# EAGLE schematic sigother (EAGLE 6.2)
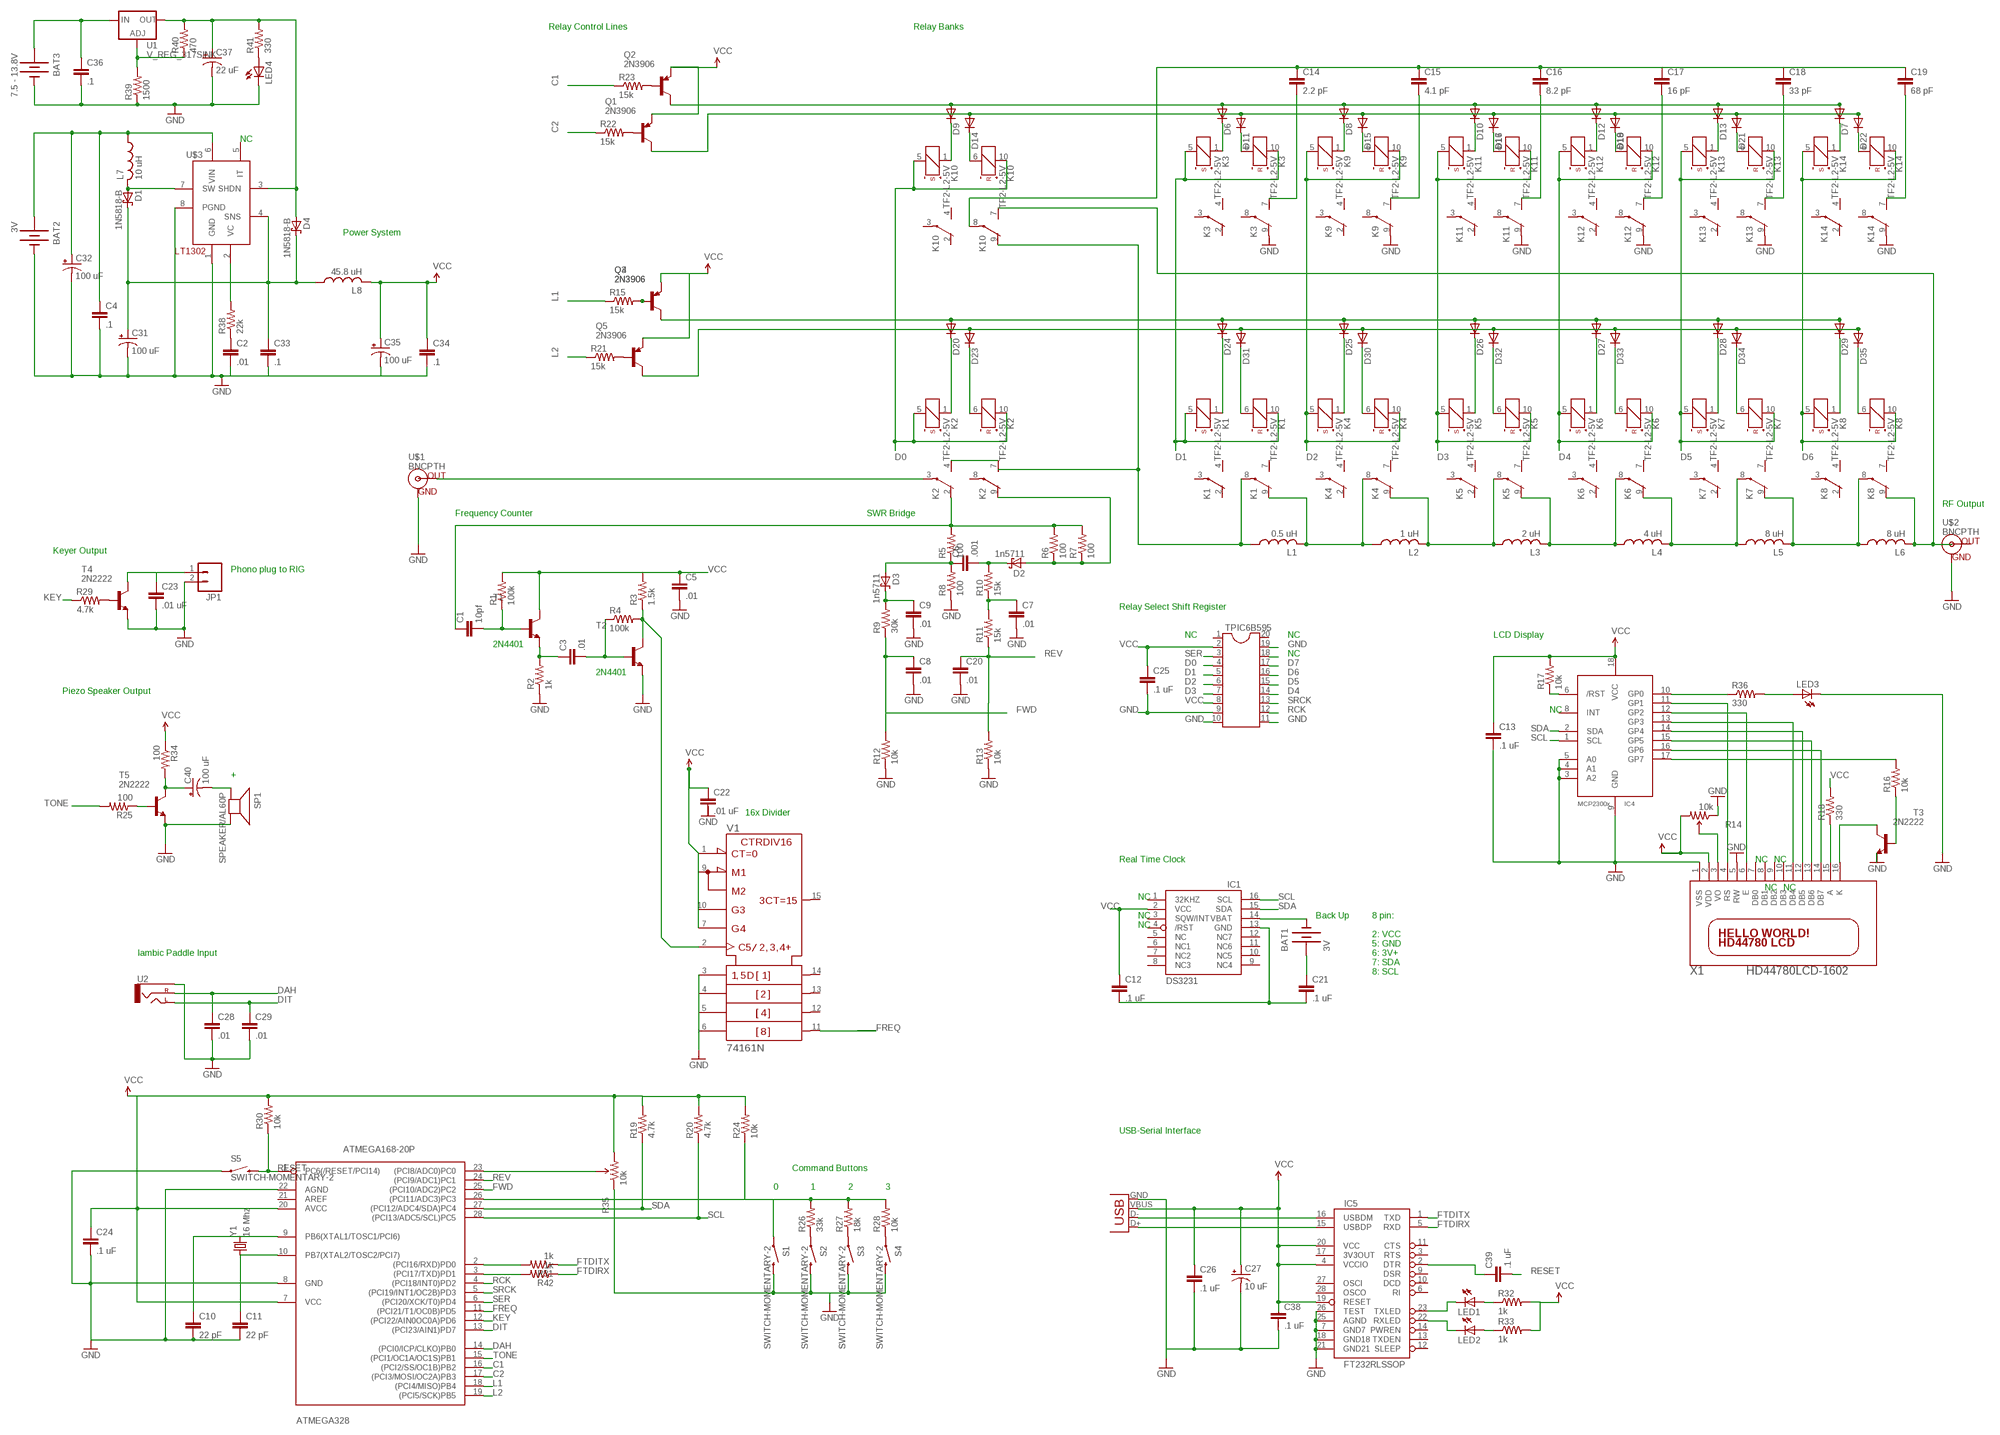
[diagram p0: schematic, sheet 1]

## Parts
ATMEGA328  ATMEGA168-20P  [DIL28-3]
BAT1  3V  BATTERY12PTH  [BATTCON_12MM_PTH]
BAT2  3V  BATTERYAA  [BATTERY-AA]
BAT3  7.5 - 13.8V  BATTERYAA  [BATTERY-AA]
C1  10pf  CAPKIT  [CAP-PTH-SMALL-KIT]
C2  .01  CAPKIT  [CAP-PTH-SMALL-KIT]
C3  .01  CAPKIT  [CAP-PTH-SMALL-KIT]
C4  .1  CAPKIT  [CAP-PTH-SMALL-KIT]
C5  .01  CAPKIT  [CAP-PTH-SMALL-KIT]
C6  .001  CAPKIT  [CAP-PTH-SMALL-KIT]
C7  .01  CAPKIT  [CAP-PTH-SMALL-KIT]
C8  .01  CAPKIT  [CAP-PTH-SMALL-KIT]
C9  .01  CAPKIT  [CAP-PTH-SMALL-KIT]
C10  22 pF  CAPKIT  [CAP-PTH-SMALL-KIT]
C11  22 pF  CAPKIT  [CAP-PTH-SMALL-KIT]
C12  .1 uF  CAPKIT  [CAP-PTH-SMALL-KIT]
C13  .1 uF  CAPKIT  [CAP-PTH-SMALL-KIT]
C14  2.2 pF  CAPKIT  [CAP-PTH-SMALL-KIT]
C15  4.1 pF  CAPKIT  [CAP-PTH-SMALL-KIT]
C16  8.2 pF  CAPKIT  [CAP-PTH-SMALL-KIT]
C17  16 pF  CAPKIT  [CAP-PTH-SMALL-KIT]
C18  33 pF  CAPKIT  [CAP-PTH-SMALL-KIT]
C19  68 pF  CAPKIT  [CAP-PTH-SMALL-KIT]
C20  .01  CAPKIT  [CAP-PTH-SMALL-KIT]
C21  .1 uF  CAPKIT  [CAP-PTH-SMALL-KIT]
C22  .01 uF  CAPKIT  [CAP-PTH-SMALL-KIT]
C23  .01 uF  CAPKIT  [CAP-PTH-SMALL-KIT]
C24  .1 uF  CAPKIT  [CAP-PTH-SMALL-KIT]
C25  .1 uF  CAPKIT  [CAP-PTH-SMALL-KIT]
C26  .1 uF  CAPKIT  [CAP-PTH-SMALL-KIT]
C27  10 uF  CAP_POLPTH1  [CPOL-RADIAL-100UF-25V]
C28  .01  CAPKIT  [CAP-PTH-SMALL-KIT]
C29  .01  CAPKIT  [CAP-PTH-SMALL-KIT]
C31  100 uF  CAP_POLPTH1  [CPOL-RADIAL-100UF-25V]
C32  100 uF  CAP_POLPTH1  [CPOL-RADIAL-100UF-25V]
C33  .1  CAPKIT  [CAP-PTH-SMALL-KIT]
C34  .1  CAPKIT  [CAP-PTH-SMALL-KIT]
C35  100 uF  CAP_POLPTH1  [CPOL-RADIAL-100UF-25V]
C36  .1  CAPKIT  [CAP-PTH-SMALL-KIT]
C37  22 uF  CAP_POLPTH1  [CPOL-RADIAL-100UF-25V]
C38  .1 uF  CAPKIT  [CAP-PTH-SMALL-KIT]
C39  .1 uF  CAPKIT  [CAP-PTH-SMALL-KIT]
C40  100 uF  CAP_POLPTH1  [CPOL-RADIAL-100UF-25V]
D1  1N5818-B  [DO41-7.6]
D2  1n5711  SCHOTTKY-DIODEC4111-15  [C4111-15]
D3  1n5711  SCHOTTKY-DIODEC4111-15  [C4111-15]
D4  1N5818-B  [DO41-7.6]
D6  DIODE1N4148  [DIODE-1N4148]
D7  DIODE1N4148  [DIODE-1N4148]
D8  DIODE1N4148  [DIODE-1N4148]
D9  DIODE1N4148  [DIODE-1N4148]
D10  DIODE1N4148  [DIODE-1N4148]
D11  DIODE1N4148  [DIODE-1N4148]
D12  DIODE1N4148  [DIODE-1N4148]
D13  DIODE1N4148  [DIODE-1N4148]
D14  DIODE1N4148  [DIODE-1N4148]
D15  DIODE1N4148  [DIODE-1N4148]
D16  DIODE1N4148  [DIODE-1N4148]
D17  DIODE1N4148  [DIODE-1N4148]
D18  DIODE1N4148  [DIODE-1N4148]
D19  DIODE1N4148  [DIODE-1N4148]
D20  DIODE1N4148  [DIODE-1N4148]
D21  DIODE1N4148  [DIODE-1N4148]
D22  DIODE1N4148  [DIODE-1N4148]
D23  DIODE1N4148  [DIODE-1N4148]
D24  DIODE1N4148  [DIODE-1N4148]
D25  DIODE1N4148  [DIODE-1N4148]
D26  DIODE1N4148  [DIODE-1N4148]
D27  DIODE1N4148  [DIODE-1N4148]
D28  DIODE1N4148  [DIODE-1N4148]
D29  DIODE1N4148  [DIODE-1N4148]
D30  DIODE1N4148  [DIODE-1N4148]
D31  DIODE1N4148  [DIODE-1N4148]
D32  DIODE1N4148  [DIODE-1N4148]
D33  DIODE1N4148  [DIODE-1N4148]
D34  DIODE1N4148  [DIODE-1N4148]
D35  DIODE1N4148  [DIODE-1N4148]
IC1  DS3231/SO  [SO16W]
IC4  MCP2300X/P  [DIL18]
IC5  FT232RLSSOP  [SSOP28DB]
JP1  M02LOCK_LONGPADS  [1X02_LOCK_LONGPADS]
K1  TF2-L2-5V  [TF2]
K2  TF2-L2-5V  [TF2]
K3  TF2-L2-5V  [TF2]
K4  TF2-L2-5V  [TF2]
K5  TF2-L2-5V  [TF2]
K6  TF2-L2-5V  [TF2]
K7  TF2-L2-5V  [TF2]
K8  TF2-L2-5V  [TF2]
K9  TF2-L2-5V  [TF2]
K10  TF2-L2-5V  [TF2]
K11  TF2-L2-5V  [TF2]
K12  TF2-L2-5V  [TF2]
K13  TF2-L2-5V  [TF2]
K14  TF2-L2-5V  [TF2]
L1  0.5 uH  L-USTJ5-U1  [TJ5-U1]
L2  1 uH  L-USTJ5-U1  [TJ5-U1]
L3  2 uH  L-USTJ5-U1  [TJ5-U1]
L4  4 uH  L-USTJ5-U1  [TJ5-U1]
L5  8 uH  L-USTJ5-U1  [TJ5-U1]
L6  8 uH  L-USTJ5-U1  [TJ5-U1]
L7  10 uH  L-USTJ5-U1  [TJ5-U1]
L8  45.8 uH  L-USTJ5-U1  [TJ5-U1]
LED1  LED-3MM-NO_SILK  [LED3MM-NS]
LED2  LED-3MM-NO_SILK  [LED3MM-NS]
LED3  LED3MM  [LED3MM]
LED4  LED3MM  [LED3MM]
Q1  2N3906  [TO92]
Q2  2N3906  [TO92]
Q3  2N3906  [TO92]
Q4  2N3906  [TO92]
Q5  2N3906  [TO92]
R1  100k  RESISTORPTH-1/4W  [AXIAL-0.4]
R2  1k  RESISTORPTH-1/4W  [AXIAL-0.4]
R3  1.5k  RESISTORPTH-1/4W  [AXIAL-0.4]
R4  100k  RESISTORPTH-1/4W  [AXIAL-0.4]
R5  100  RESISTORPTH-1/4W  [AXIAL-0.4]
R6  100  RESISTORPTH-1/4W  [AXIAL-0.4]
R7  100  RESISTORPTH-1/4W  [AXIAL-0.4]
R8  100  RESISTORPTH-1/4W  [AXIAL-0.4]
R9  30k  RESISTORPTH-1/4W  [AXIAL-0.4]
R10  15k  RESISTORPTH-1/4W  [AXIAL-0.4]
R11  15k  RESISTORPTH-1/4W  [AXIAL-0.4]
R12  10k  RESISTORPTH-1/4W  [AXIAL-0.4]
R13  10k  RESISTORPTH-1/4W  [AXIAL-0.4]
R14  10k  TRIMPOTPTH  [TRIM_POT_PTH]
R15  15k  RESISTORPTH-1/4W  [AXIAL-0.4]
R16  10k  RESISTORPTH-1/4W  [AXIAL-0.4]
R17  10k  RESISTORPTH-1/4W  [AXIAL-0.4]
R18  330  RESISTORPTH-1/4W  [AXIAL-0.4]
R19  4.7k  RESISTORPTH-1/4W  [AXIAL-0.4]
R20  4.7k  RESISTORPTH-1/4W  [AXIAL-0.4]
R21  15k  RESISTORPTH-1/4W  [AXIAL-0.4]
R22  15k  RESISTORPTH-1/4W  [AXIAL-0.4]
R23  15k  RESISTORPTH-1/4W  [AXIAL-0.4]
R24  10k  RESISTORPTH-1/4W  [AXIAL-0.4]
R25  100  RESISTORPTH-1/4W  [AXIAL-0.4]
R26  33k  RESISTORPTH-1/4W  [AXIAL-0.4]
R27  18k  RESISTORPTH-1/4W  [AXIAL-0.4]
R28  10k  RESISTORPTH-1/4W  [AXIAL-0.4]
R29  4.7k  RESISTORPTH-1/4W  [AXIAL-0.4]
R30  10k  RESISTORPTH-1/4W  [AXIAL-0.4]
R31  1k  RESISTORPTH-1/4W  [AXIAL-0.4]
R32  1k  RESISTORPTH-1/4W  [AXIAL-0.4]
R33  1k  RESISTORPTH-1/4W  [AXIAL-0.4]
R34  100  RESISTORPTH-1/4W  [AXIAL-0.4]
R35  10k  TRIMPOTPTH  [TRIM_POT_PTH]
R36  330  RESISTORPTH-1/4W  [AXIAL-0.4]
R38  22k  RESISTORPTH-1/4W  [AXIAL-0.4]
R39  1500  RESISTORPTH-1/4W  [AXIAL-0.4]
R40  470  RESISTORPTH-1/4W  [AXIAL-0.4]
R41  330  RESISTORPTH-1/4W  [AXIAL-0.4]
R42  1k  RESISTORPTH-1/4W  [AXIAL-0.4]
S1  SWITCH-MOMENTARY-2  [TACTILE_SWITCH_TALL]
S2  SWITCH-MOMENTARY-2  [TACTILE_SWITCH_TALL]
S3  SWITCH-MOMENTARY-2  [TACTILE_SWITCH_TALL]
S4  SWITCH-MOMENTARY-2  [TACTILE_SWITCH_TALL]
S5  SWITCH-MOMENTARY-2  [TACTILE_SWITCH_TALL]
SP1  SPEAKER/AL60P  [AL60P]
T1  2N4401-NPN-TO92-EBC  [TO92-EBC]
T2  2N4401-NPN-TO92-EBC  [TO92-EBC]
T3  2N2222  [TO92-EBC-OVAL]
T4  2N2222  [TO92-EBC-OVAL]
T5  2N2222  [TO92-EBC-OVAL]
TPIC6B595  DIL20  [DIL20]
U1  V_REG_317SINK  [TO220-ADJ]
U2  AUDIO-JACKSMD2  [AUDIO-JACK-3.5MM-SMD]
U$1  BNCPTH  [BNC]
U$2  BNCPTH  [BNC]
U$3  LT1302  [DIL08]
V1  74161N  [DIL16]
X1  HD44780LCD-1602  [LCD1602]
X2  USBPTH  [USB-B-PTH]
Y1  16 Mhz  CRYSTALHC49US  [HC49US]

## Nets
C1: ATMEGA328.16((PCI2/SS/OC1B)PB2) R23.P$1
C2: ATMEGA328.17((PCI3/MOSI/OC2A)PB3) R22.P$1
D0: K2.5(S:-) K2.10(R:+) K10.5(S:-) K10.10(R:+) TPIC6B595.4
D1: K1.5(S:-) K1.10(R:+) K3.5(S:-) K3.10(R:+) TPIC6B595.5
D2: K4.5(S:-) K4.10(R:+) K9.5(S:-) K9.10(R:+) TPIC6B595.6
D3: K5.5(S:-) K5.10(R:+) K11.5(S:-) K11.10(R:+) TPIC6B595.7
D4: K6.5(S:-) K6.10(R:+) K12.5(S:-) K12.10(R:+) TPIC6B595.14
D5: K7.5(S:-) K7.10(R:+) K13.5(S:-) K13.10(R:+) TPIC6B595.15
D6: K8.5(S:-) K8.10(R:+) K14.5(S:-) K14.10(R:+) TPIC6B595.16
D7: TPIC6B595.17
DAH: ATMEGA328.14((PCI0/ICP/CLKO)PB0) C28.1 U2.RING(RIGHT)
DIT: ATMEGA328.13((PCI23/AIN1)PD7) C29.1 U2.TIP(LEFT)
FREQ: ATMEGA328.11((PCI21/T1/OC0B)PD5) V1.11(QD)
FTDIRX: IC5.5(RXD) R42.P$1
FTDITX: IC5.1(TXD) R31.P$1
FWD: ATMEGA328.25((PCI10/ADC2)PC2) C8.1 R9.P$1 R12.P$2
GND: ATMEGA328.8(GND) ATMEGA328.22(AGND) BAT2.GND@1(-) BAT3.GND@1(-) C2.2 C4.2 C5.2 C7.2 C8.2 C9.2 C10.2 C11.2 C13.2 C20.2 C23.2 C24.2 C25.2 C26.2 C27.2(-) C28.2 C29.2 C31.2(-) C32.2(-) C33.2 C34.2 C35.2(-) C36.2 C37.2(-) C38.2 IC4.3(A2) IC4.4(A1) IC4.5(A0) IC4.9(GND) IC5.7(GND7) IC5.18(GND18) IC5.21(GND21) IC5.25(AGND) IC5.26(TEST) JP1.2 K3.9(2:O) K9.9(2:O) K11.9(2:O) K12.9(2:O) K13.9(2:O) K14.9(2:O) LED3.K(C) LED4.K(C) R2.P$1 R8.P$1 R12.P$1 R13.P$1 R14.1(CCW) R35.1(CCW) R39.P$1 S1.B2 S2.B2 S3.B2 S4.B2 S5.A2 SP1.2(-) T2.E T3.E T4.E T5.E TPIC6B595.9 TPIC6B595.10 TPIC6B595.11 TPIC6B595.19 U2.SLEEVE U$1.GND U$2.GND U$3.1(GND) U$3.8(PGND) V1.3(A) V1.4(B) V1.5(C) V1.6(D) X1.1(VSS) X1.5(RW) X2.GND
KEY: ATMEGA328.12((PCI22/AIN0OC0A)PD6) R29.P$1
L1: ATMEGA328.18((PCI4/MISO)PB4) R15.P$1
L2: ATMEGA328.19((PCI5/SCK)PB5) R21.P$1
N$1: K2.4(1:S) K2.7(2:S)
N$2: K1.8(2:P) K10.9(2:O) L1.1
N$3: C1.2 R1.P$1 T1.B
N$4: R38.P$2 U$3.2(VC)
N$5: C3.1 R2.P$2 T1.E
N$6: C3.2 R4.P$1 T2.B
N$7: R3.P$1 R4.P$2 T2.C V1.2(CLK)
N$8: C2.1 R38.P$1
N$9: C6.1 D3.A R5.P$1 R8.P$2
N$10: D2.A K2.9(2:O) R6.P$1 R7.P$1
N$11: C1.1 R5.P$2 R6.P$2 R7.P$2
N$12: ATMEGA328.26((PCI11/ADC3)PC3) R24.P$1 R26.P$2 R27.P$2 R28.P$2 S1.A2
N$13: C6.2 D2.C R10.P$2
N$14: C14.2 K3.7(2:S)
N$15: C9.1 D3.C R9.P$2
N$16: C7.1 R10.P$1 R11.P$2
N$17: R14.2(WIPER) X1.3(VO)
N$18: BAT1.GND(-) IC1.14(VBAT)
N$19: IC4.11(GP1) X1.4(RS)
N$20: IC4.12(GP2) X1.6(E)
N$21: IC4.13(GP3) X1.11(DB4)
N$22: IC4.14(GP4) X1.12(DB5)
N$23: IC4.15(GP5) X1.13(DB6)
N$24: IC4.16(GP6) X1.14(DB7)
N$25: IC4.17(GP7) R16.P$2
N$26: R16.P$1 T3.B
N$27: T3.C X1.16(K)
N$28: IC4.6(/RST) R17.P$1
N$29: C15.2 K9.7(2:S)
N$30: K1.9(2:O) K4.8(2:P) L1.2 L2.1
N$31: K4.9(2:O) K5.8(2:P) L2.2 L3.1
N$32: U$1.S(OUT)
N$33: K5.9(2:O) K6.8(2:P) L3.2 L4.1
N$34: K6.9(2:O) K7.8(2:P) L4.2 L5.1
N$35: C16.2 K11.7(2:S)
N$36: R18.P$1 X1.15(A)
N$37: K7.9(2:O) K8.8(2:P) L5.2 L6.1
N$38: K8.9(2:O) K10.7(2:S) L6.2
N$39: C12.2 C21.2 IC1.13(GND)
N$40: C17.2 K12.7(2:S)
N$41: BAT1.VCC@1(+) C21.1
N$42: C18.2 K13.7(2:S)
N$43: TPIC6B595.18
N$44: D6.A D8.A D9.A D10.A D12.A D13.A Q2.1(C)
N$45: D11.A D14.A D15.A D16.A D17.A D18.A D19.A D21.A D22.A Q1.1(C)
N$46: C19.2 K14.7(2:S)
N$47: C39.1 IC5.2(DTR)
N$48: D11.C K3.6(R:-)
N$49: C14.1 C15.1 C16.1 C17.1 C18.1 C19.1 K10.8(2:P)
N$50: D8.C K9.1(S:+)
N$51: D16.C D17.C K11.6(R:-)
N$52: D18.C D19.C K12.6(R:-)
N$53: D15.C K9.6(R:-)
N$54: D7.A
N$55: D6.C K3.1(S:+)
N$56: D10.C K11.1(S:+)
N$57: D12.C K12.1(S:+)
N$58: D13.C K13.1(S:+)
N$59: D21.C K13.6(R:-)
N$60: D7.C K14.1(S:+)
N$61: D22.C K14.6(R:-)
N$62: D9.C K10.1(S:+)
N$63: D14.C K10.6(R:-)
N$64: Q3.2(B) Q4.2(B) R15.P$2
N$65: R25.P$1 T5.B
N$66: D20.A D24.A D25.A D26.A D27.A D28.A D29.A Q3.1(C) Q4.1(C)
N$67: D23.A D30.A D31.A D32.A D33.A D34.A D35.A Q5.1(C)
N$68: D24.C K1.1(S:+)
N$69: D31.C K1.6(R:-)
N$70: D25.C K4.1(S:+)
N$71: D30.C K4.6(R:-)
N$72: D26.C K5.1(S:+)
N$73: D32.C K5.6(R:-)
N$74: D27.C K6.1(S:+)
N$75: D33.C K6.6(R:-)
N$76: D28.C K7.1(S:+)
N$77: D34.C K7.6(R:-)
N$78: D29.C K8.1(S:+)
N$79: D35.C K8.6(R:-)
N$80: Q5.2(B) R21.P$2
N$81: Q1.2(B) R22.P$2
N$82: Q2.2(B) R23.P$2
N$83: R26.P$1 S2.A2
N$84: R27.P$1 S3.A2
N$85: R28.P$1 S4.A2
N$86: ATMEGA328.2((PCI16/RXD)PD0) R31.P$2
N$87: IC5.16(USBDM) X2.D-
N$88: R29.P$2 T4.B
N$89: ATMEGA328.9(PB6(XTAL1/TOSC1/PCI6)) C10.1 Y1.2
N$90: C23.1 JP1.1 T4.C
N$91: ATMEGA328.10(PB7(XTAL2/TOSC2/PCI7)) C11.1 Y1.1
N$92: ATMEGA328.3((PCI17/TXD)PD1) R42.P$2
N$93: C40.2(-) SP1.1(+)
N$94: IC5.15(USBDP) X2.D+
N$95: IC5.23(TXLED) LED1.K(C)
N$96: D20.C K2.1(S:+)
N$97: D23.C K2.6(R:-)
N$98: IC5.22(RXLED) LED2.K(C)
N$99: LED1.A R32.P$1
N$100: LED2.A R33.P$1
N$101: IC4.10(GP0) R36.P$1
N$102: ATMEGA328.23((PCI8/ADC0)PC0) R35.2(WIPER)
N$103: LED3.A R36.P$2
N$104: C40.1(+) R34.P$2 T5.C
N$105: D1.A L7.2 U$3.7(SW)
N$106: BAT2.PWR@1(+) C4.1 C32.1(+) L7.1 U$3.6(VIN)
N$107: C31.1(+) C33.1 D1.C D4.C L8.1 U$3.4(SNS)
N$109: BAT3.PWR@1(+) C36.1 U1.IN
N$111: R39.P$2 R40.P$1 U1.ADJ
N$112: C37.1(+) D4.A R40.P$2 R41.P$2 U1.OUT U$3.3(SHDN)
N$113: LED4.A R41.P$1
RCK: ATMEGA328.4((PCI18/INT0)PD2) TPIC6B595.12
RESET: ATMEGA328.1(PC6(/RESET/PCI14)) C39.2 R30.P$1 S5.B2
REV: ATMEGA328.24((PCI9/ADC1)PC1) C20.1 R11.P$1 R13.P$2
SCL: ATMEGA328.28((PCI13/ADC5/SCL)PC5) IC1.16(SCL) IC4.1(SCL) R20.P$1
SDA: ATMEGA328.27((PCI12/ADC4/SDA)PC4) IC1.15(SDA) IC4.2(SDA) R19.P$1
SER: ATMEGA328.6((PCI20/XCK/T0)PD4) TPIC6B595.3
SRCK: ATMEGA328.5((PCI19/INT1/OC2B)PD3) TPIC6B595.13
TONE: ATMEGA328.15((PCI1/OC1A/OC1S)PB1) R25.P$2
VCC: ATMEGA328.7(VCC) ATMEGA328.20(AVCC) C5.1 C12.1 C13.1 C22.1 C24.1 C25.1 C26.1 C27.1(+) C34.1 C35.1(+) C38.1 IC1.2(VCC) IC4.18(VCC) IC5.4(VCCIO) IC5.19(RESET) IC5.20(VCC) L8.2 Q1.3(E) Q2.3(E) Q3.3(E) Q4.3(E) Q5.3(E) R1.P$2 R3.P$2 R14.3(CW) R17.P$2 R18.P$2 R19.P$2 R20.P$2 R24.P$2 R30.P$2 R32.P$2 R33.P$2 R34.P$1 R35.3(CW) T1.C TPIC6B595.2 TPIC6B595.8 V1.1(!CLR) V1.7(ENP) V1.9(!LOAD) V1.10(ENT) X1.2(VDD) X2.VBUS
Unconnected: ATMEGA328.21(AREF) C22.2 IC1.1(32KHZ) IC1.3(SQW/INT) IC1.4(/RST) IC1.5(NC) IC1.6(NC1) IC1.7(NC2) IC1.8(NC3) IC1.9(NC4) IC1.10(NC5) IC1.11(NC6) IC1.12(NC7) IC4.8(INT) IC5.3(RTS) IC5.6(RI) IC5.9(DSR) IC5.10(DCD) IC5.11(CTS) IC5.12(SLEEP) IC5.13(TXDEN) IC5.14(PWREN) IC5.17(3V3OUT) IC5.27(OSCI) IC5.28(OSCO) K1.2(1:O) K1.3(1:P) K1.4(1:S) K1.7(2:S) K2.2(1:O) K2.3(1:P) K2.8(2:P) K3.2(1:O) K3.3(1:P) K3.4(1:S) K3.8(2:P) K4.2(1:O) K4.3(1:P) K4.4(1:S) K4.7(2:S) K5.2(1:O) K5.3(1:P) K5.4(1:S) K5.7(2:S) K6.2(1:O) K6.3(1:P) K6.4(1:S) K6.7(2:S) K7.2(1:O) K7.3(1:P) K7.4(1:S) K7.7(2:S) K8.2(1:O) K8.3(1:P) K8.4(1:S) K8.7(2:S) K9.2(1:O) K9.3(1:P) K9.4(1:S) K9.8(2:P) K10.2(1:O) K10.3(1:P) K10.4(1:S) K11.2(1:O) K11.3(1:P) K11.4(1:S) K11.8(2:P) K12.2(1:O) K12.3(1:P) K12.4(1:S) K12.8(2:P) K13.2(1:O) K13.3(1:P) K13.4(1:S) K13.8(2:P) K14.2(1:O) K14.3(1:P) K14.4(1:S) K14.8(2:P) TPIC6B595.1 TPIC6B595.20 U$2.S(OUT) U$3.5(IT) V1.12(QC) V1.13(QB) V1.14(QA) V1.15(RCO) X1.7(DB0) X1.8(DB1) X1.9(DB2) X1.10(DB3)

## Notes on the sheet
- Relay Control Lines | Relay Banks
- NC
- Power System
- RF Output
- Frequency Counter | SWR Bridge
- Keyer Output
- Phono plug to RIG
- Relay Select Shift Register
- NC | NC | LCD Display
- 2N4401
- NC
- 2N4401
- Piezo Speaker Output
- NC
- +
- 16x Divider
- Real Time Clock | NC | NC
- NC | NC
- NC
- NC | Back Up | 8 pin:
- NC
- 2: VCC
- 5: GND
- Iambic Paddle Input | 6: 3V+
- 7: SDA
- 8: SCL
- USB-Serial Interface
- Command Buttons
- 0 | 1 | 2 | 3

## Power pins joined to a net without a drawn wire
+UB: V1.16(+UB)
-UB: V1.8(-UB)

## Library data of the parts
ATMEGA328 = adafruit:ATMEGA168*P: MICROCONTROLLER 16 kBytes FLASH 1 kBytes SRAM 512 Bytes EEPROM USART 8-channel 10 bit ADC
BAT1-BAT3 = SparkFun:BATTERY: Battery Holders Various common sizes : AA, AAA, 20mm coin cell and 12mm coin cell.
C1-C26 C28 C29 C33 C34 C36 C38 C39 = SparkFun:CAP: Capacitor Standard 0603 ceramic capacitor, and 0.1" leaded capacitor.
C27 C31 C32 C35 C37 C40 = SparkFun:CAP_POL: Capacitor Polarized These are standard SMD and PTH capacitors. Normally 10uF, 47uF, and 100uF in electrolytic and tantalum varieties. Always verify the external diameter of the through hole cap, it varies with capacity, voltage, and manufacturer. The EIA devices should be standard.
D1 D4 = diode:1N581*: 1.0A SCHOTTKY BARRIER RECTIFIER Source: http://www.diodes.com/datasheets/ds23001.pdf
D2 D3 = adafruit:SCHOTTKY-DIODE: Schottky Diode
D6-D35 = SparkFun:DIODE: Diode These are standard reverse protection diodes and small signal diodes. SMA package can handle up to about 1A. SOD-323 can handle about 200mA. What the SOD-323 package when ordering, there are some mfgs out there that are 5-pin packages.
IC1 = adafruit:DS3231
IC4 = adafruit:MCP2300X: MCP23008 Inexpensive i2c i/o expander - 8 general purpose i/o pins with optional pullups
IC5 = SparkFun:FT232RL: USB UART FT232RL 4th Generation USB UART (USB <-> Serial) Controller. Spark Fun Electronics SKU : COM-00650
JP1 = SparkFun:M02: Header 2 Standard 2-pin 0.1" header. Use with straight break away headers (SKU : PRT-00116), right angle break away headers (PRT-00553), swiss pins (PRT-00743), machine pins (PRT-00117), and female headers (PRT-00115). Molex polarized connector foot print use with SKU : PRT-08233 with associated crimp pins and housings.
K1-K14 = relay:TF2-L2*: SMALL POLARIZED RELAY WITH HIGH SENSITIVITY NAiS 2 coil latching Source: http://www.mew-europe.com/.. en_ds_61017_0000.pdf; OC_FARNELL: unknown; OC_NEWARK: unknown
L1-L8 = rcl:L-US: INDUCTOR, American symbol
LED1-LED4 = SparkFun:LED: LEDs Standard schematic elements and footprints for 5mm, 3mm, 1206, and 0603 sized LEDs. 5mm - Spark Fun Electronics SKU : COM-00529 (and others)
Q1-Q5 = transistor-pnp:2N3906: PNP Transistor
R1-R13 R15-R34 R36 R38-R42 = SparkFun:RESISTOR: Resistor Basic schematic elements and footprints for 0603, 1206, and PTH resistors.
R14 R35 = SparkFun:TRIMPOT
S1-S5 = SparkFun:SWITCH-MOMENTARY-2
SP1 = adafruit:SPEAKER: SPEAKER Source: Buerklin Added PS12 (for part # PS1240 piezo) http://www.ladyada.net/library/pcb/eaglelibrary.html
T1 T2 = transistor-neu-to92:*-NPN-: NPN Transistror
T3-T5 = adafruit:2N2222: NPN TRANSISTOR Big oval pads
TPIC6B595 = ic-package:DIL20: Dual In Line / Socket
U1 = SparkFun:V_REG_317: Voltage Regulator Standard LM317 adjustable voltage regulator. AOI (Adjust Output Input). Google 'LM317 Calculator' for easy to use app to get the two resistor values needed. 240/720 for 5V output. 240/390 for 3.3V output. Spark Fun Electronics SKU : COM-00527
U2 = SparkFun:AUDIO-JACK: 3.5mm Audio Jack Simple 3.5mm common PCB mount audio jack. SKU: PRT-08032
U$1 U$2 = SparkFun:BNC: BNC Connector, Mouser Part# 5227161
U$3 = adafruit:LT1302
V1 = 74ttl-din:74*161: Synchrounus 4-bit COUNTER
X1 = adafruit:HD44780LCD: HD44780 LCD Standard character type LCDs, available in sizes from 8x1 to 40x4!
X2 = SparkFun:USB: USB Connectors USB-B-PTH is fully proven SKU : PRT-00139 USB-miniB is fully proven SKU : PRT-00587 USB-A-PCB is untested. USB-A-H is throughly reviewed, but untested. Spark Fun Electronics SKU : PRT-00437 USB-B-SMT is throughly reviewed, but untested. Needs silkscreen touching up. USB-A-S has not been used/tested USB-MB-H has not been used/tested
Y1 = SparkFun:CRYSTAL: Crystals Various standard crystals. Proven footprints. Spark Fun Electronics SKU : COM-00534